# EAGLE design Adafruit 2.2in TFT HAT rev A (EAGLE 6.3)
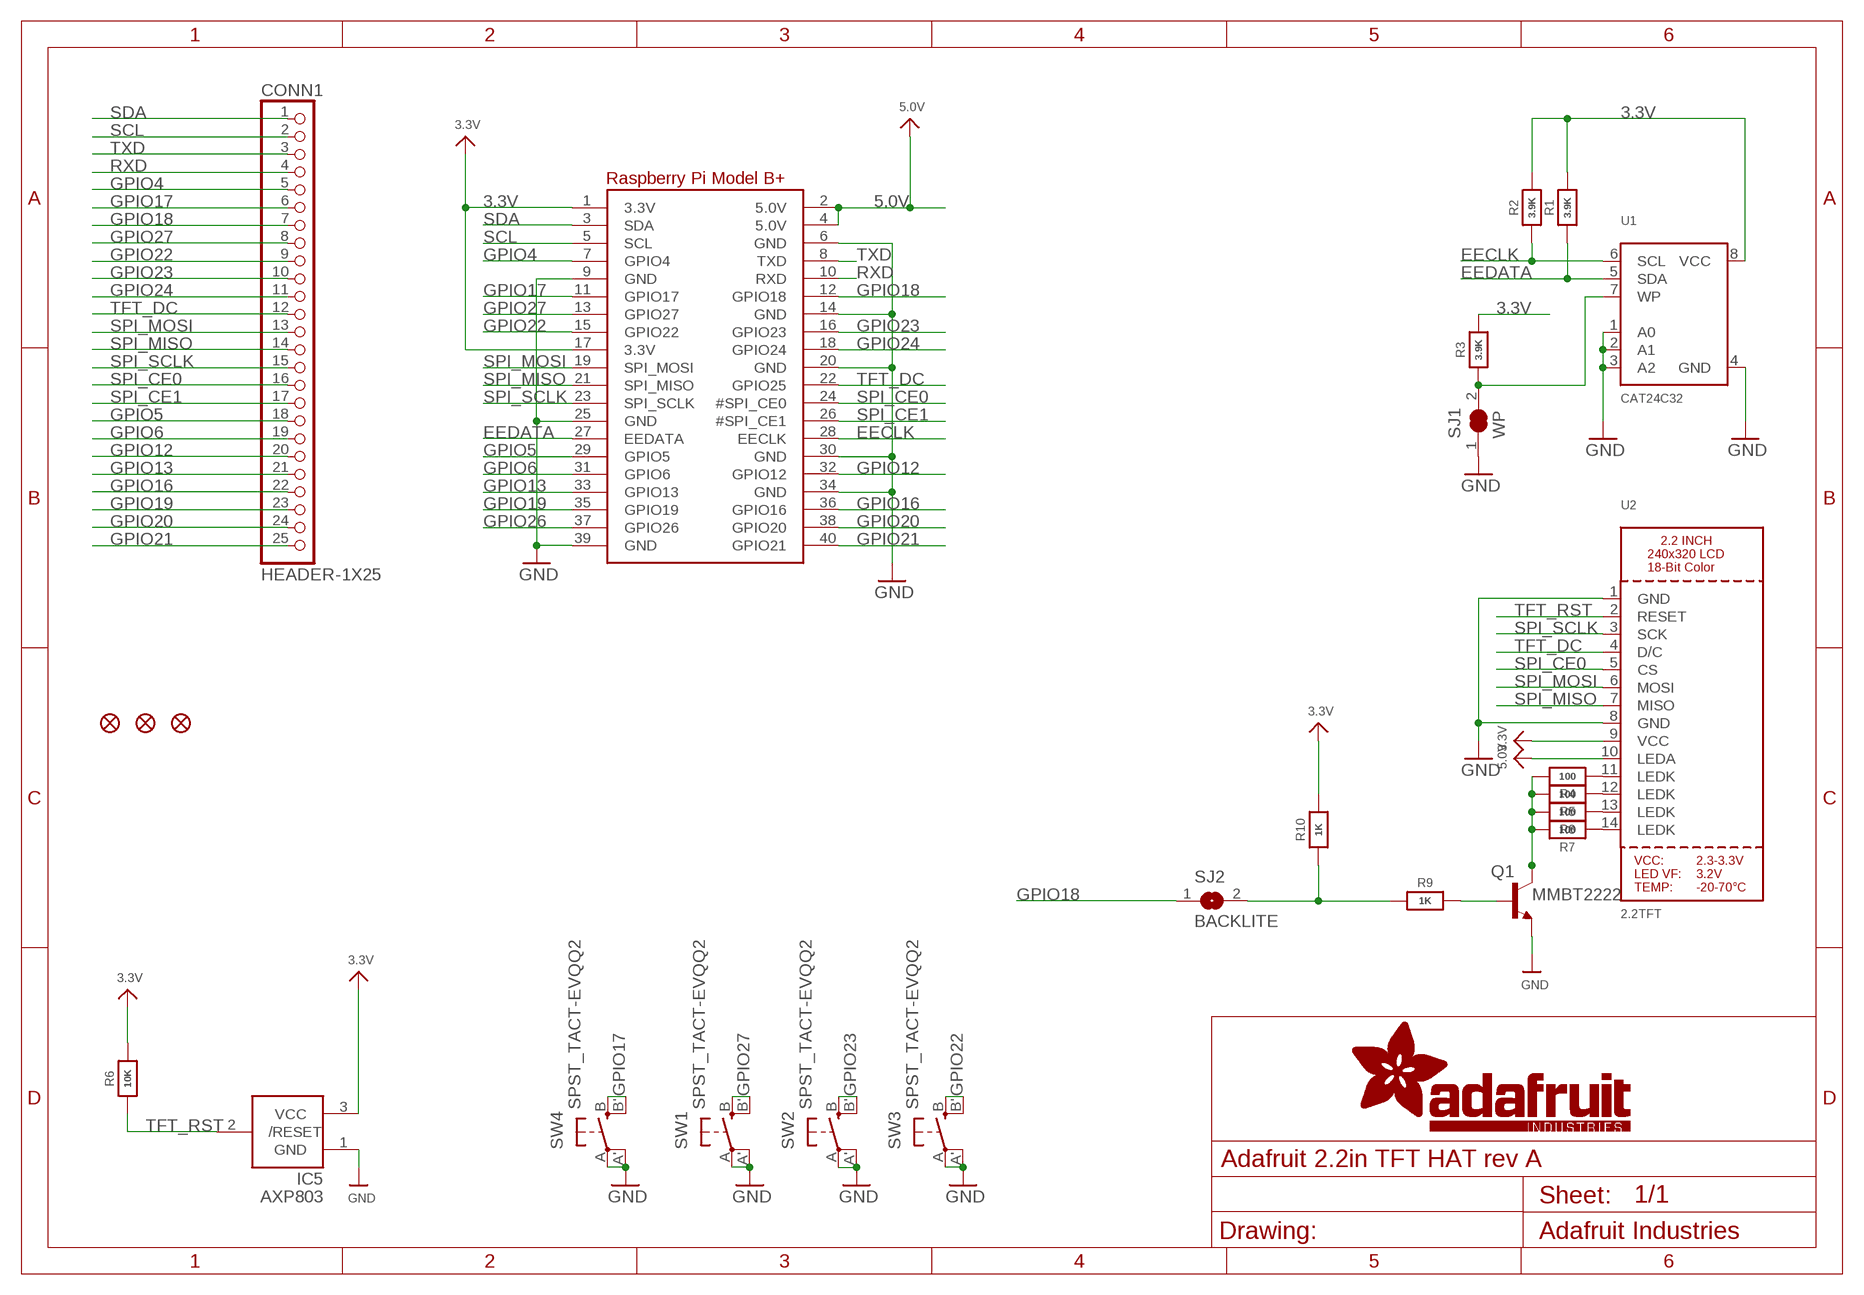
[diagram p0: schematic, sheet 1]

## Parts
CONN1  HEADER-1X25  [1X25_ROUND_70MIL]
FID1  FIDUCIAL""  [FIDUCIAL_1MM]
FID2  FIDUCIAL""  [FIDUCIAL_1MM]
FID3  FIDUCIAL""  [FIDUCIAL_1MM]
IC5  AXP803  AXP083-SAG  [SOT23]
Q1  MMBT2222  MMBT2222ALT1-NPN-SOT23-BEC  [SOT23-BEC]
R1  3.9K  RESISTOR0805_NOOUTLINE  [0805-NO]
R2  3.9K  RESISTOR0805_NOOUTLINE  [0805-NO]
R3  3.9K  RESISTOR0805_NOOUTLINE  [0805-NO]
R4  100  RESISTOR0805_NOOUTLINE  [0805-NO]
R5  100  RESISTOR0805_NOOUTLINE  [0805-NO]
R6  10K  RESISTOR0805_NOOUTLINE  [0805-NO]
R7  100  RESISTOR0805_NOOUTLINE  [0805-NO]
R8  100  RESISTOR0805_NOOUTLINE  [0805-NO]
R9  1K  RESISTOR0805_NOOUTLINE  [0805-NO]
R10  1K  RESISTOR0805_NOOUTLINE  [0805-NO]
RPI1  RASPBERRYPI_BPLUS_HATNOSLOTS  [PI_HAT_NOSLOTS]
SJ1  WP  SOLDERJUMPER_CLOSED  [SOLDERJUMPER_CLOSEDWIRE]
SJ2  BACKLITE  SOLDERJUMPERCLOSED  [SOLDERJUMPER_CLOSEDWIRE]
SW1  SPST_TACT-EVQQ2  [EVQ-Q2]
SW2  SPST_TACT-EVQQ2  [EVQ-Q2]
SW3  SPST_TACT-EVQQ2  [EVQ-Q2]
SW4  SPST_TACT-EVQQ2  [EVQ-Q2]
U1  CAT24C32  EEPROM_I2C_SOIC8_GENERIC  [SOIC8_150MIL]
U2  2.2TFT  DISP_LCD_TM022HDH26  [TM022HDH26_2.2IN_LCD]

## Nets
3.3V: IC5.3(VCC) R1.2 R2.2 R3.2 R6.2 R10.2 RPI1.1(3.3V) RPI1.17(3.3V) U1.8(VCC) U2.9(VCC)
5.0V: RPI1.2(5.0V) RPI1.4(5.0V) U2.10(LEDA)
EECLK: R2.1 RPI1.28(EECLK) U1.6(SCL)
EEDATA: R1.1 RPI1.27(EEDATA) U1.5(SDA)
GND: IC5.1(GND) Q1.E RPI1.6(GND) RPI1.9(GND) RPI1.14(GND) RPI1.20(GND) RPI1.25(GND) RPI1.30(GND) RPI1.34(GND) RPI1.39(GND) SJ1.1 SW1.A'(P1) SW1.A(P) SW2.A'(P1) SW2.A(P) SW3.A'(P1) SW3.A(P) SW4.A'(P1) SW4.A(P) U1.1(A0) U1.2(A1) U1.3(A2) U1.4(GND) U2.1(GND) U2.8(GND)
GPIO4: CONN1.5 RPI1.7(GPIO4)
GPIO5: CONN1.18 RPI1.29(GPIO5)
GPIO6: CONN1.19 RPI1.31(GPIO6)
GPIO12: CONN1.20 RPI1.32(GPIO12)
GPIO13: CONN1.21 RPI1.33(GPIO13)
GPIO16: CONN1.22 RPI1.36(GPIO16)
GPIO17: CONN1.6 RPI1.11(GPIO17) SW4.B'(S1) SW4.B(S)
GPIO18: CONN1.7 RPI1.12(GPIO18) SJ2.1
GPIO19: CONN1.23 RPI1.35(GPIO19)
GPIO20: CONN1.24 RPI1.38(GPIO20)
GPIO21: CONN1.25 RPI1.40(GPIO21)
GPIO22: CONN1.9 RPI1.15(GPIO22) SW3.B'(S1) SW3.B(S)
GPIO23: CONN1.10 RPI1.16(GPIO23) SW2.B'(S1) SW2.B(S)
GPIO24: CONN1.11 RPI1.18(GPIO24)
GPIO26: RPI1.37(GPIO26)
GPIO27: CONN1.8 RPI1.13(GPIO27) SW1.B'(S1) SW1.B(S)
N$1: R4.1 U2.11(LEDK)
N$2: R5.1 U2.12(LEDK)
N$3: R7.1 U2.14(LEDK)
N$4: R8.1 U2.13(LEDK)
N$5: Q1.C R4.2 R5.2 R7.2 R8.2
N$6: Q1.B R9.2
N$8: R9.1 R10.1 SJ2.2
N$16: R3.1 SJ1.2 U1.7(WP)
RXD: CONN1.4 RPI1.10(RXD)
SCL: CONN1.2 RPI1.5(SCL)
SDA: CONN1.1 RPI1.3(SDA)
SPI_CE0: CONN1.16 RPI1.24(#SPI_CE0) U2.5(CS)
SPI_CE1: CONN1.17 RPI1.26(#SPI_CE1)
SPI_MISO: CONN1.14 RPI1.21(SPI_MISO) U2.7(MISO)
SPI_MOSI: CONN1.13 RPI1.19(SPI_MOSI) U2.6(MOSI)
SPI_SCLK: CONN1.15 RPI1.23(SPI_SCLK) U2.3(SCK)
TFT_DC: CONN1.12 RPI1.22(GPIO25) U2.4(D/C)
TFT_RST: IC5.2(/RESET) R6.1 U2.2(RESET)
TXD: CONN1.3 RPI1.8(TXD)

## Library data of the parts
CONN1 = microbuilder:HEADER-1X25
FID1-FID3 = microbuilder:FIDUCIAL: Fiducial Alignment Points Various fiducial points for machine vision alignment.; BOM: EXCLUDE
IC5 = adafruit:AXP083
Q1 = transistor-neu-to92:*-NPN-: NPN Transistror
R1-R10 = microbuilder:RESISTOR: Resistors For new designs, use the packages preceded by an '_' character since they are more reliable: The following footprints should be used on most boards: _0402 - Standard footprint for regular board layouts _0603 - Standard footprint for regular board layouts _0805 - Standard footprint for regular board layouts _1206 - Standard footprint for regular board layouts For extremely tight-pitch boards where space is at a premium, the following 'micro-pitch' footprints can be used (smaller pads, no silkscreen outline, etc.): _0402MP - Micro-pitch footprint for very dense/compact boards _0603MP - Micro-pitch footprint for very dense/compact boards _0805MP - Micro-pitch footprint for very dense/compact boards _1206MP - Micro-pitch footprint for very dense/compact boards
RPI1 = microbuilder:RASPBERRYPI_BPLUS
SJ1 = microbuilder:SOLDERJUMPER_CLOSED: Solder Jumper - Closed These solder jumpers are closed by default CLOSEDWIRE - 10 mil trace between pads that can be cut and resoldered later CLOSEDPERM - 63 mil trace between pads for a permanent connection (used to 'bridge' two signals, a shameless hack for Eagle). Can double as a test point as well (no cream layer)
SJ2 = microbuilder:SOLDERJUMPER: SMD Solder JUMPER Solder the two pads together to create a connection, or remove the solder to break it. REFLOW - Use this footprint for solder paste and reflow ovens. WAVE - Use this footprint for hand-soldering (larger pads). CLOSED - Has a trace between the two pads to ensure it is closed by default. The trace needs to be cut to disable the jumper, and can be closed again by creating a solder bridge between the two pads.
SW1-SW4 = adafruit:SPST_TACT: SMT 6mm switch, EVQQ2 series http://www.ladyada.net/library/eagle
U1 = microbuilder:EEPROM_I2C_SOIC8_GENERIC: Note: The same pinout is used for many I2C EEPROMs in SOIC8(150mil) from a variety of manufacturers and in various sizes. Examples: 16K (2K x 8 Bit) I2C EEPROM 1.7-5.5V, 400KHz, -40°C-85°C Digikey: CAT24C16WI-GT3CT-ND 256K (32K x 8 Bit) I2C EEPROM 1.7-5.5V, 400KHz, -40°C-85°C Digikey: 24AA256-I/SN-ND
U2 = microbuilder:DISP_LCD_TM022HDH26: TM022HDH26 2.2 Inch 240x320 18-bit LCD - ILI9340C Controller

## Board
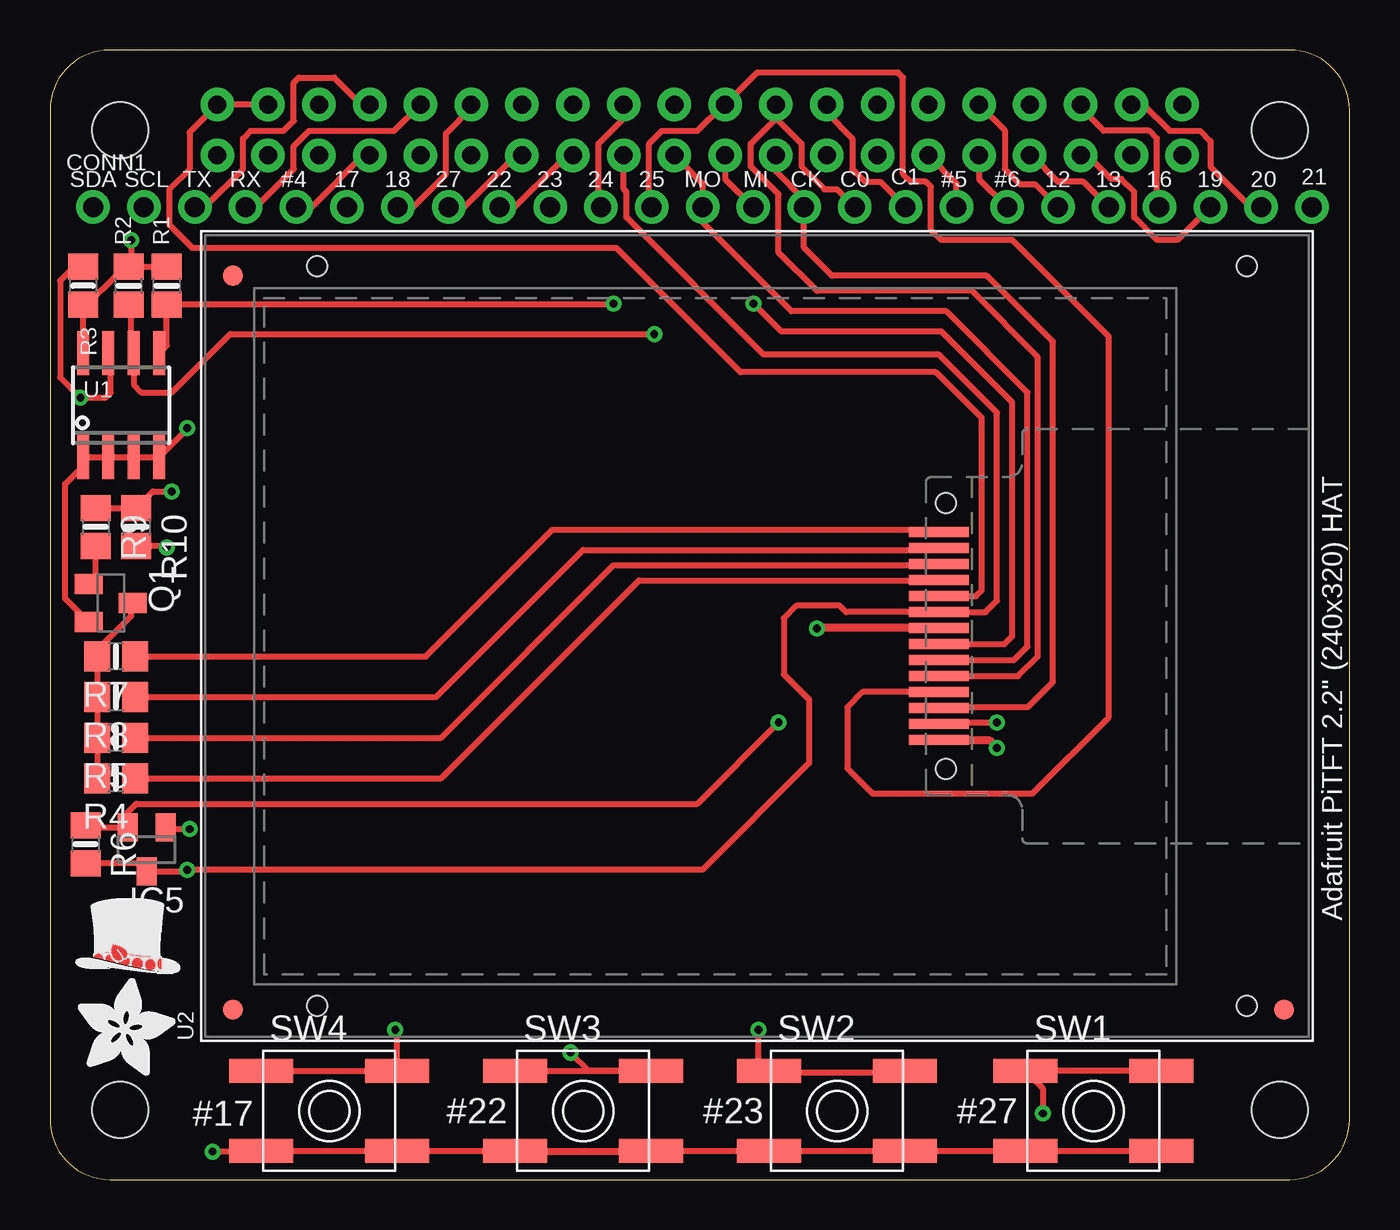
[diagram p1: board, top side]
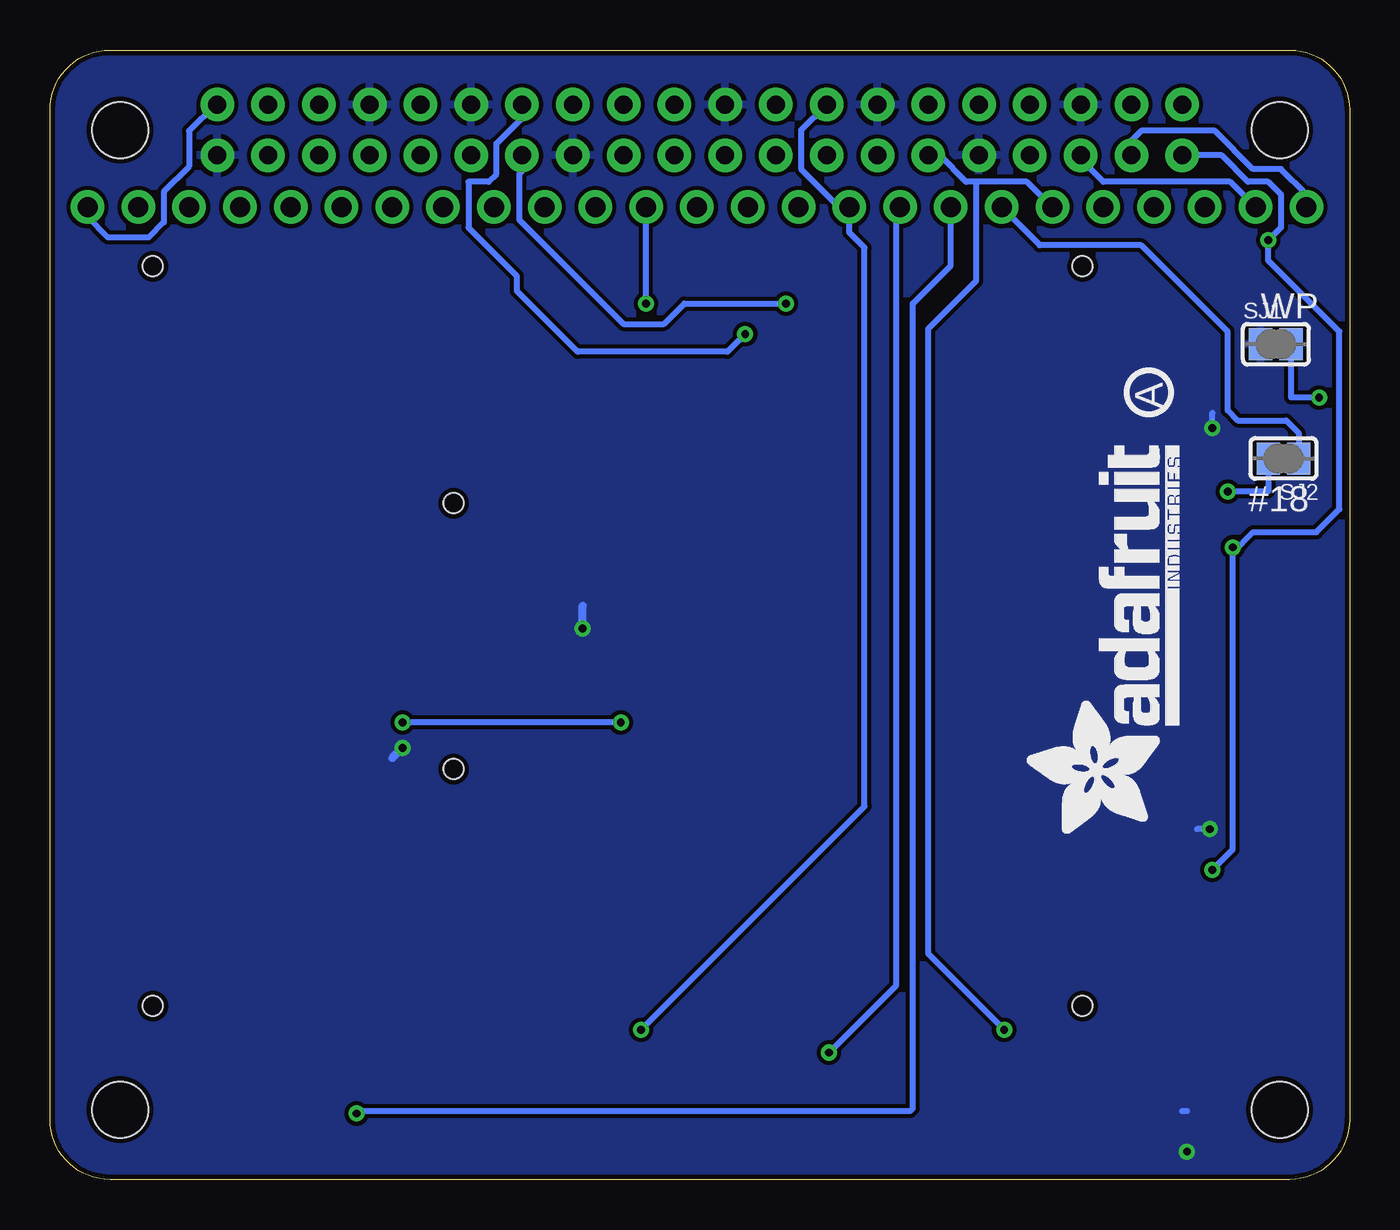
[diagram p2: board, bottom side, seen from below]

Size 65 x 56.5 mm. Coordinates in mm from the lower left corner, seen from the top.
Copper layers (1*16): Top 0.035mm / dielectric 1.5mm / Bottom 0.035mm
Design rules "adafruit *": minimum track width 8mil, minimum drill 15.5mil, track to track 8mil, track to pad 8mil, pad to pad 8mil, via to via 8mil, smd to smd 8mil, copper to edge 10mil, drill to drill 8mil, minimum pad ring 10mil, minimum via ring 8mil, stop-mask expansion 2mil, vias tented up to drill 20mil, thermal gap 10mil

### Footprints (pad centres in the part's own frame; a part is rotated, then mirrored left to right if it is on the bottom)
1X25_ROUND_70MIL = drill 1 pad 1.676: 1 -30.48,0; 2 -27.94,0; 3 -25.4,0; 4 -22.86,0; 5 -20.32,0; 6 -17.78,0; 7 -15.24,0; 8 -12.7,0; 9 -10.16,0; 10 -7.62,0; 11 -5.08,0; 12 -2.54,0; 13 0,0; 14 2.54,0; 15 5.08,0; 16 7.62,0; 17 10.16,0; 18 12.7,0; 19 15.24,0; 20 17.78,0; 21 20.32,0; 22 22.86,0; 23 25.4,0; 24 27.94,0; 25 30.48,0
FIDUCIAL_1MM = smd 1 x 1: 1 0,0
SOT23 = smd 1 x 1.4: 1 -0.95,-1.1; 2 0.95,-1.1; 3 0,1.1
SOT23-BEC = smd 1 x 1.4: B -0.95,-1.1; C 0,1.1; E 0.95,-1.1
0805-NO = smd 1.3 x 1.5: 1 -0.95,0; 2 0.95,0
PI_HAT_NOSLOTS = drill 0.9 pad 1.676: 1 8.37,51.23; 2 8.37,53.77; 3 10.91,51.23; 4 10.91,53.77; 5 13.45,51.23; 6 13.45,53.77; 7 15.99,51.23; 8 15.99,53.77; 9 18.53,51.23; 10 18.53,53.77; 11 21.07,51.23; 12 21.07,53.77; 13 23.61,51.23; 14 23.61,53.77; 15 26.15,51.23; 16 26.15,53.77; 17 28.69,51.23; 18 28.69,53.77; 19 31.23,51.23; 20 31.23,53.77; 21 33.77,51.23; 22 33.77,53.77; 23 36.31,51.23; 24 36.31,53.77; 25 38.85,51.23; 26 38.85,53.77; 27 41.39,51.23; 28 41.39,53.77; 29 43.93,51.23; 30 43.93,53.77; 31 46.47,51.23; 32 46.47,53.77; 33 49.01,51.23; 34 49.01,53.77; 35 51.55,51.23; 36 51.55,53.77; 37 54.09,51.23; 38 54.09,53.77; 39 56.63,51.23; 40 56.63,53.77 | hole 2.8: 3.5,3.5; 3.5,52.5; 61.5,52.5; 61.5,3.5
SOLDERJUMPER_CLOSEDWIRE = smd 1.168 x 1.6: 1 -0.762,0; 2 0.762,0 | smd 0.635 x 0.203: WIRE 0,0
EVQ-Q2 = smd 3.2 x 1.2: A -3.4,-2; A' 3.4,-2; B -3.4,2; B' 3.4,2
SOIC8_150MIL = smd 0.6 x 2.2: 1 -1.905,-2.6; 2 -0.635,-2.6; 3 0.635,-2.6; 4 1.905,-2.6; 5 1.905,2.6; 6 0.635,2.6; 7 -0.635,2.6; 8 -1.905,2.6
TM022HDH26_2.2IN_LCD = smd 0.5 x 3: 1 -5.2,-11.184; 2 -4.4,-11.184; 3 -3.6,-11.184; 4 -2.8,-11.184; 5 -2,-11.184; 6 -1.2,-11.184; 7 -0.4,-11.184; 8 0.4,-11.184; 9 1.2,-11.184; 10 2,-11.184; 11 2.8,-11.184; 12 3.6,-11.184; 13 4.4,-11.184; 14 5.2,-11.184 | hole 1: -6.65,-11.534; 6.65,-11.534; 18.5,19.92; -18.5,19.92; -18.5,-26.58; 18.5,-26.58

### Placement (x,y rotation side)
CONN1  32.64,48.64 0 top
FID1  9.14,8.51 0 top
FID2  9.14,45.21 0 top
FID3  61.72,8.51 0 top
IC5  4.83,16.51 180 top
Q1  3.05,28.83 270 top
R1  5.84,44.7 90 top
R2  3.94,44.7 90 top
R3  1.65,44.7 270 top
R4  3.3,20.07 180 top
R5  3.3,22.1 180 top
R6  1.78,16.76 270 top
R7  3.3,26.16 180 top
R8  3.3,24.13 180 top
R9  2.29,32.64 270 top
R10  4.32,32.64 270 top
RPI1  0,0 0 top
SJ1  3.68,41.78 0 bottom
SJ2  3.3,36.07 180 bottom
SW1  52.2,3.43 0 top
SW2  39.37,3.43 0 top
SW3  26.67,3.43 0 top
SW4  13.97,3.43 0 top
U1  3.56,38.73 0 top
U2  33.27,27.18 90 top
U$1  [ADAFRUIT_5MM]  1.4,5.21 0 top
U$3  [ADAFRUIT_TEXT_20MM]  8.51,17.14 90 bottom
U$4  [PIHATLOGO]  1.27,10.29 0 top
U$12  [PCBFEAT-REV-056]  10.03,39.37 270 bottom

### Tracks (layer width: path | path; a pad name or v marks a point on that pad's centre or on a via)
3.3V  (via drill 0.39)
  Top 0.305: R6.2 4.42,15.81 IC5.3 6.77,15.41 v6.86,15.49 32.64,15.49 37.97,20.83 37.97,24 36.7,25.27 36.7,28.07 37.34,28.7 39.5,28.7 39.82,28.38 U2.9 46.79,28.38 47.37,28.96 47.37,38.35 44.45,41.27 35.69,41.27 28.83,48.13 28.83,49.4 28.69,49.54 RPI1.17 | U1.8 R3.2 1.84,43.75 3.3,45.21 3.88,45.21 3.88,45.65 R2.2 | R2.2 R1.2 | v5.84,31.62 5.78,31.69 R10.2 | v4.06,46.99 4.06,45.97 3.94,45.85 R2.2
  Bottom 0.305: v6.86,15.49 5.84,16.51 5.84,31.37 | 5.84,31.37 v5.84,31.62 | 5.84,31.37 4.83,32.38 1.65,32.38 0.51,33.53 0.51,42.42 4.06,45.97 v4.06,46.99 3.43,47.62 3.43,49.28 4.06,49.91 5.08,49.91 6.4,51.23 RPI1.1
5.0V
  Top 0.305: U2.10 46.32,29.18 46.61,29.46 46.61,38.1 44.32,40.39 34.54,40.39 28.32,46.61 7.11,46.61 5.97,47.75 5.97,49.53 6.99,50.55 6.99,52.38 RPI1.2 RPI1.4
EECLK  (via drill 0.39)
  Top 0.305: R2.1 3.94,43.81 4.06,43.69 4.06,41.46 U1.6 4.19,39.75 4.57,39.37 6.1,39.37 9.02,42.29 v30.23,42.29
  Bottom 0.305: v30.23,42.29 31.11,41.4 38.61,41.4 41.66,44.45 41.66,45.21 44.07,47.62 44.07,49.91 43.05,49.91 42.67,50.29 42.67,51.82 41.39,53.1 RPI1.28
EEDATA  (via drill 0.39)
  Top 0.305: U1.5 5.84,41.72 R1.1 28.25,43.75 v28.19,43.81
  Bottom 0.305: v28.19,43.81 33.27,43.81 34.29,42.8 36.32,42.8 41.53,48.01 41.53,50.29 41.4,50.42 41.4,51.23 RPI1.27
GND  (via drill 0.39)
  Top 0.305: Q1.E 0.76,29.07 0.76,34.8 1.65,35.69 U1.1 U1.2 U1.3 U1.4 6.86,37.53 v6.86,37.59 | SW3.A SW3.A' | IC5.1 5.86,17.53 v6.99,17.53 | SW3.A SW4.A' SW4.A 10.54,1.4 v8.13,1.4 | SW1.A' SW1.A SW2.A' SW2.A 30.77,1.43 30.73,1.4 23.3,1.4 SW3.A
  Top 0.406: U2.1 46.98,21.98 v47.37,21.59 | U2.8 38.37,27.58 v38.35,27.56
  Bottom 0.305: v6.86,37.59 6.86,38.35 | 8.38,3.43 8.13,3.43 | v6.99,17.53 7.62,17.53
  Bottom 0.406: v47.37,21.59 47.88,21.08 | v38.35,27.56 38.35,28.7
  pour Bottom: 0,0 0,56.64 65.02,56.64 65.02,0
GPIO4
  Top 0.305: CONN1.5 13.08,48.64 15.67,51.23 RPI1.7
GPIO5
  Top 0.305: CONN1.18 45.34,49.82 RPI1.29
GPIO6
  Top 0.305: RPI1.31 46.47,50.05 CONN1.19
GPIO12
  Top 0.305: RPI1.32 47.75,52.49 47.75,50.55 48.51,49.78 49.28,49.78 CONN1.20
GPIO13
  Top 0.305: CONN1.21 51.69,49.91 50.42,49.91 49.1,51.23 RPI1.33
GPIO16
  Top 0.305: CONN1.22 55.37,48.77 55.37,52.07 54.99,52.45 52.7,52.45 51.55,53.61 RPI1.36
GPIO17  (via drill 0.39)
  Top 0.305: SW4.B SW4.B' 17.37,7.39 v17.27,7.49
  Bottom 0.305: v17.27,7.49 21.07,11.29 21.07,42.56 18.67,44.96 18.67,49.91 | CONN1.6 16.13,49.91 18.67,49.91 | 18.67,49.91 19.18,49.91 20.5,51.23 RPI1.11
GPIO18
  Top 0.305: CONN1.7 18.16,48.64 19.81,50.29 19.81,52.32 21.07,53.58 RPI1.12
  Bottom 0.305: 2.29,36.32 SJ2.1 2.54,37.34 3.17,37.97 5.59,37.97 6.1,38.48 6.1,42.42 10.41,46.74 15.49,46.74 CONN1.7
GPIO19
  Top 0.305: CONN1.23 56.39,46.99 55.37,46.99 54.23,48.13 54.23,49.4 53.59,50.04 53.09,50.04 51.89,51.23 RPI1.35
GPIO20
  Top 0.305: RPI1.38 54.69,53.77 56.01,52.45 57.53,52.45 58.04,51.94 58.04,50.67 60.07,48.64 CONN1.24
GPIO21
  Bottom 0.305: RPI1.40 56.72,53.77 58.04,52.45 58.04,50.67 59.31,49.4 59.31,47.88 60.07,47.12 62.1,47.12 63.12,48.13 CONN1.25
GPIO22  (via drill 0.39)
  Top 0.305: SW3.B SW3.B' 26.96,5.43 v26.04,6.35 | CONN1.9 23.24,48.64 25.4,50.8 25.72,50.8 RPI1.15
  Bottom 0.305: v26.04,6.35 22.67,9.72 22.67,48.64 CONN1.9
GPIO23  (via drill 0.39)
  Top 0.305: SW2.B' 42.67,5.33 36.45,5.33 36.35,5.43 SW2.B 35.43,5.97 v35.43,7.49
  Bottom 0.305: v35.43,7.49 24.26,18.67 24.26,46.61 25.02,47.37 CONN1.10 25.53,48.64 27.43,50.55 27.43,52.49 RPI1.16
GPIO24
  Top 0.305: CONN1.11 27.43,48.77 27.43,51.82 28.69,53.07 RPI1.18
GPIO27  (via drill 0.39)
  Top 0.305: SW1.B' SW1.B 49.66,4.57 v49.66,3.3 | CONN1.8 20.7,48.64 22.86,50.8 23.18,50.8 RPI1.13
  Bottom 0.305: v49.66,3.3 49.53,3.43 21.97,3.43 21.84,3.56 21.84,43.81 19.94,45.72 CONN1.8
N$1
  Top 0.305: R4.1 19.56,20.07 29.46,29.97 U2.11
N$2
  Top 0.305: R5.1 19.56,22.1 28.19,30.73 44.41,30.73 U2.12
N$3
  Top 0.305: R7.1 18.8,26.16 25.15,32.51 44.32,32.51 U2.14
N$4
  Top 0.305: R8.1 19.3,24.13 26.67,31.5 44.38,31.5 U2.13
N$5
  Top 0.305: R4.2 R5.2 R8.2 R7.2 2.67,26.16 2.67,26.8 4.06,28.19 4.06,28.75 Q1.C
N$6
  Top 0.305: Q1.B 2.29,30.12 R9.2
N$8  (via drill 0.39)
  Top 0.305: R9.1 R10.1 5.15,34.42 v6.1,34.42
  Bottom 0.305: SJ2.2 4.06,34.42 v6.1,34.42
N$16  (via drill 0.39)
  Top 0.305: R3.1 1.2,45.65 0.51,44.96 0.51,40.13 v1.52,39.12 2.79,39.12 3.05,39.37 3.05,41.21 U1.7
  Bottom 0.305: v1.52,39.12 2.92,39.12 SJ1.2
RXD
  Top 0.305: CONN1.4 10.29,48.64 12.19,50.55 12.19,51.69 12.95,52.45 17.21,52.45 RPI1.10
SCL
  Bottom 0.305: CONN1.2 5.97,49.91 12.32,49.91 13.45,51.04 RPI1.5
SDA
  Bottom 0.305: RPI1.3 10.91,51.95 10.41,52.45 6.73,52.45 4.83,50.55 3.43,50.55 2.16,49.28 CONN1.1
SPI_CE0
  Top 0.305: RPI1.24 36.31,53.1 | 36.31,53.1 37.59,51.82 37.59,50.67 38.73,49.53 39.37,49.53 CONN1.16 | U2.5 48.42,25.18 49.4,26.16 49.4,41.15 46.1,44.45 38.35,44.45 36.45,46.35 36.45,49.28 35.05,50.67 35.05,51.82 36.31,53.07 36.31,53.1
SPI_CE1
  Top 0.305: RPI1.26 38.85,53.35 40.13,52.07 40.13,50.55 40.77,49.91 41.53,49.91 CONN1.17
SPI_MISO  (via drill 0.39)
  Top 0.305: U2.7 47.73,26.78 48.13,27.18 48.13,38.86 44.58,42.42 36.58,42.42 v35.18,43.81 | RPI1.21 33.77,50.05 CONN1.14
  Bottom 0.305: v35.18,43.81 CONN1.14
SPI_MOSI
  Top 0.305: U2.6 48.2,25.98 48.9,26.67 48.9,39.37 44.83,43.43 37.08,43.43 32.64,47.88 CONN1.13 32.64,49.82 RPI1.19
SPI_SCLK
  Top 0.305: U2.3 44.5,23.62 48.9,23.62 50.16,24.89 50.16,41.91 46.86,45.21 39.12,45.21 37.72,46.61 CONN1.15 37.72,49.02 36.31,50.43 RPI1.23
TFT_DC
  Top 0.305: CONN1.12 29.97,48.77 29.97,51.82 30.61,52.45 32.38,52.45 33.7,53.77 RPI1.22 35.37,55.37 42.42,55.37 42.67,55.12 42.67,50.29 43.05,49.91 43.81,49.91 44.07,49.66 44.07,47.5 44.58,46.99 48.13,46.99 52.96,42.16 52.96,23.11 49.15,19.3 41.15,19.3 39.88,20.57 39.88,23.62 40.63,24.38 U2.4
TFT_RST  (via drill 0.39)
  Top 0.305: U2.2 44.54,22.86 v47.37,22.86 | R6.1 1.88,17.61 IC5.2 3.88,18.35 4.32,18.8 32.38,18.8 v36.45,22.86
  Bottom 0.305: v36.45,22.86 v47.37,22.86
TXD
  Top 0.305: CONN1.3 7.75,48.64 9.65,50.55 9.65,52.07 10.03,52.45 11.68,52.45 12.19,52.96 12.19,54.86 12.45,55.12 14.22,55.12 15.57,53.77 RPI1.8

### Text on the board
tPlace: SDA | SCL | TX | RX | #4 | 17 | 18 | 27 | 22 | 23 | 24 | 25 | MO | MI | CK | C0 | C1 | #5 | #6 | 12 | 13 | 16 | 19 | 20 | 21 | Adafruit PiTFT 2.2" (240x320) HAT | #17 | #22 | #23 | #27
bPlace: WP | #18